# EAGLE design version 1.3 (EAGLE 8.1.0)

## Sheet 1 of 4
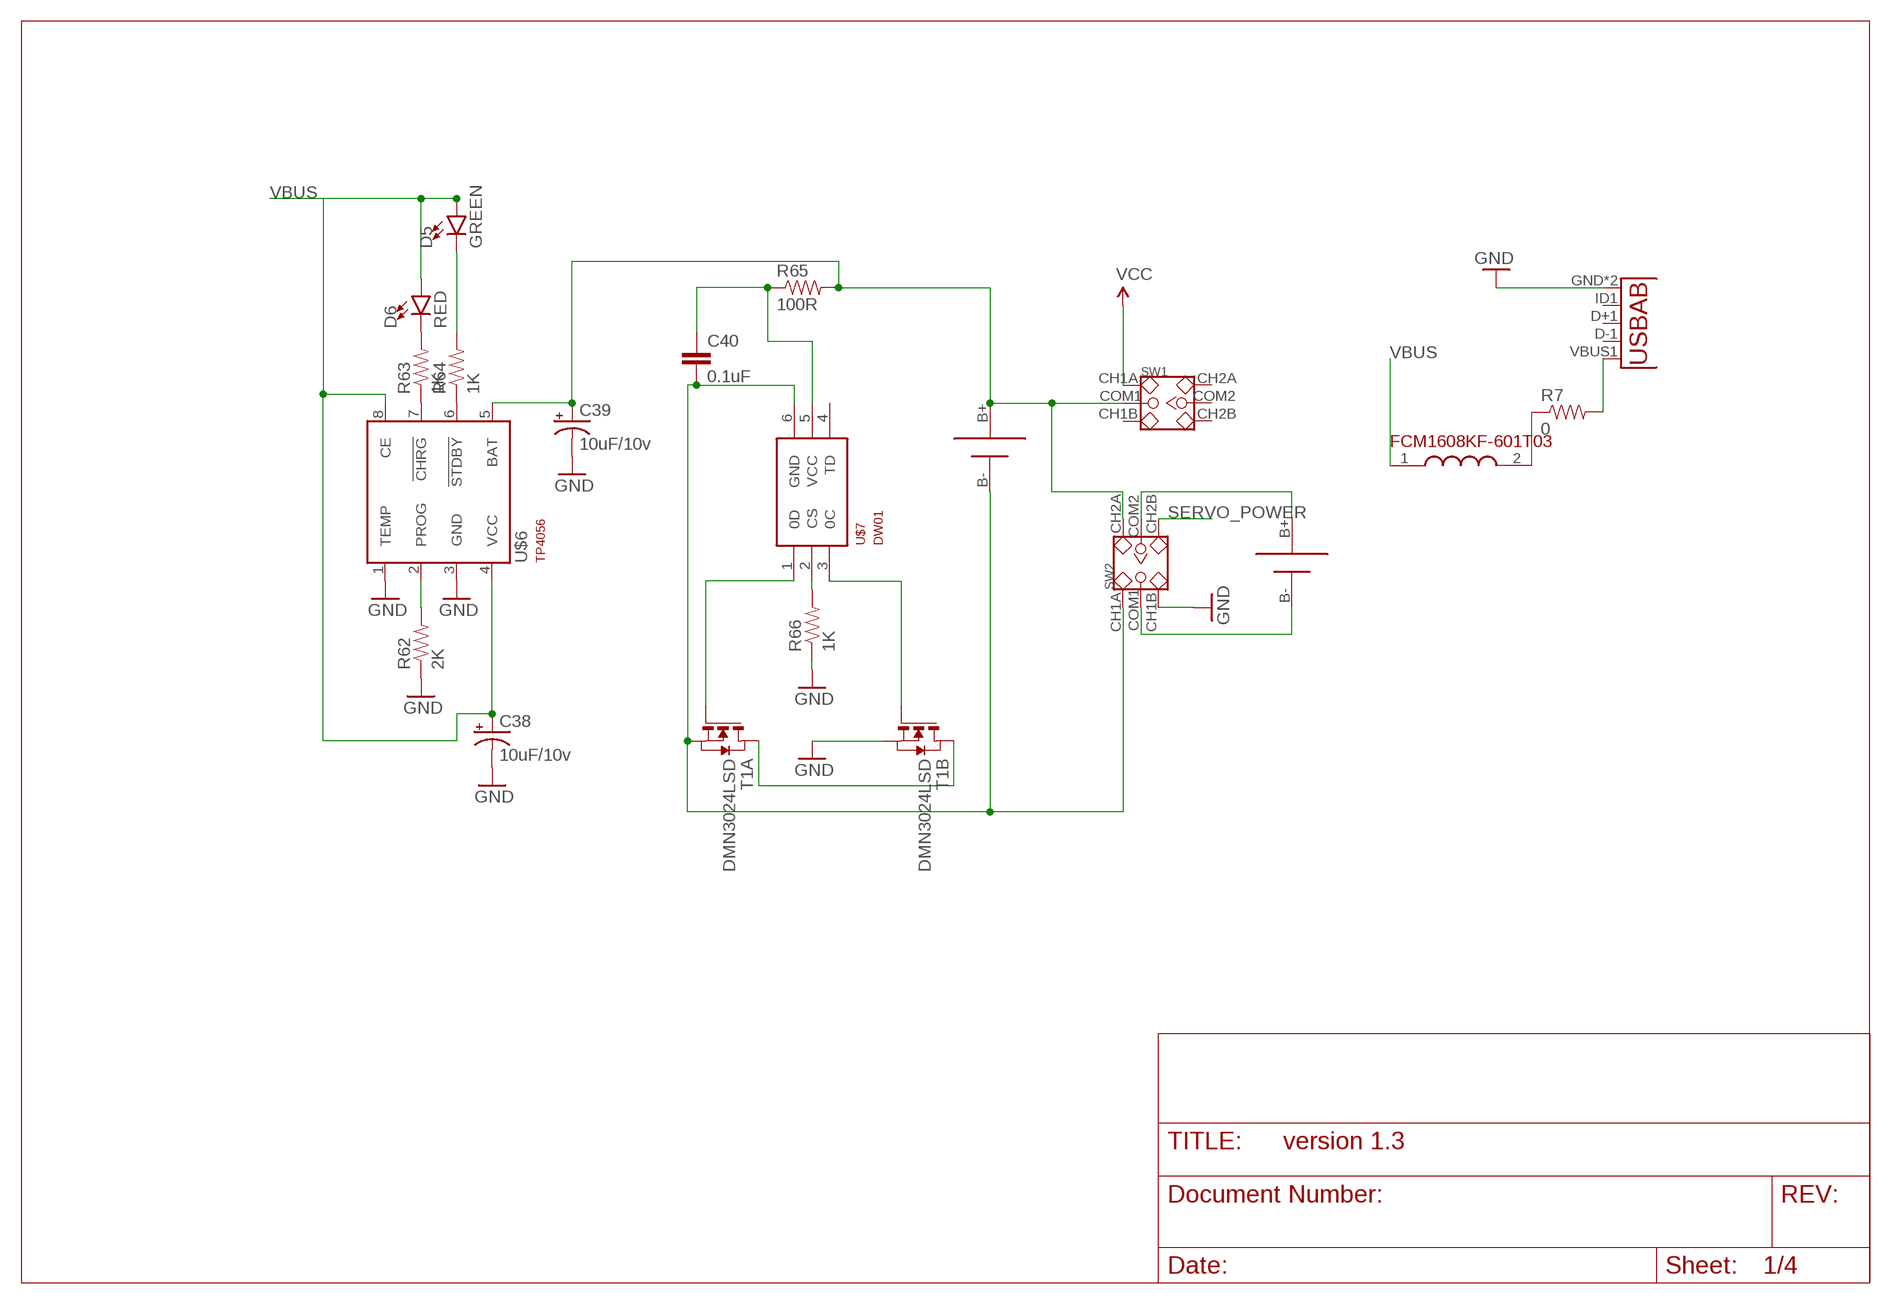
[diagram p0: schematic, sheet 1]

### Parts
C38  10uF/10v  CAP_POL1206-KIT  [EIA3216-KIT]
C39  10uF/10v  CAP_POL1206-KIT  [EIA3216-KIT]
C40  0.1uF  0.1UF-100V-10%(0603)  [0603-CAP]
D5  GREEN  LED-BLUE0603  [LED-0603]
D6  RED  LED-BLUE0603  [LED-0603]
R7  0  RESISTOR0805-RES  [0805]
R62  2K  1KOHM1/10W1%(0603)  [0603-RES]
R63  1K  1KOHM1/10W1%(0603)  [0603-RES]
R64  1K  1KOHM1/10W1%(0603)  [0603-RES]
R65  100R  1KOHM1/10W1%(0603)  [0603-RES]
R66  1K  1KOHM1/10W1%(0603)  [0603-RES]
SW1  SMD-TOGGLE-SWITCH-2CH(2X3P-7X3.5MM)  [SW6-2.54-SMD-7.0X3.5X1.5MM]
SW2  SMD-TOGGLE-SWITCH-2CH(2X3P-7X3.5MM)  [SW6-2.54-SMD-7.0X3.5X1.5MM]
T1  DMN3024LSD  [TSSOP-8]
U1  USB""  [USB-MICRO-SMD]
U$4  FCM1608KF-601T03  [FCM1608KF-601T03]
U$5  18650SMD  [18650SMD]
U$6  TP4056  [SOT23-8]
U$7  DW01  [SOT23-6]
U$8  18650SMD  [18650SMD]

### Nets
GND: C38.C(-) C39.C(-) R62.1 R66.1 SW2.CH1B T1.6(B:S) T1.7(B:S) U1.GND U1.GND1(GND) U$6.1(TEMP) U$6.3(GND) ; also sheet 2,3,4
N$3: R7.2 U1.VBUS1(VBUS)
N$4: C39.A(+) R65.2 SW1.COM1 SW2.CH2A U$5.B+ U$6.5(BAT)
N$9: SW2.COM2 U$8.B+
N$10: SW2.COM1 U$8.B-
N$11: R7.1 U$4.2(2.OUT)
N$58: R62.2 U$6.2(PROG)
N$59: R63.1 U$6.7(!CHRG)
N$60: R64.1 U$6.6(!STDBY)
N$61: D6.C R63.2
N$62: D5.C R64.2
N$65: C40.1 R65.1 U$7.5(VCC)
N$66: C40.2 SW2.CH1A T1.2(A:S) T1.3(A:S) U$5.B- U$7.6(GND)
N$67: T1.4(A:G) U$7.1(0D)
N$68: R66.2 U$7.2(CS)
N$69: T1.1(A:D) T1.8(B:D)
N$70: T1.5(B:G) U$7.3(0C)
SERVO_POWER: SW2.CH2B ; also sheet 4
VBUS: C38.A(+) D5.A D6.A U$4.1(1.IN) U$6.4(VCC) U$6.8(CE)
VCC: SW1.CH1A ; also sheet 2,3
Unconnected: SW1.CH1B SW1.CH2A SW1.CH2B SW1.COM2 U1.D+1(D+) U1.D-1(D-) U1.ID1(USBID) U$7.4(TD)

## Sheet 2 of 4
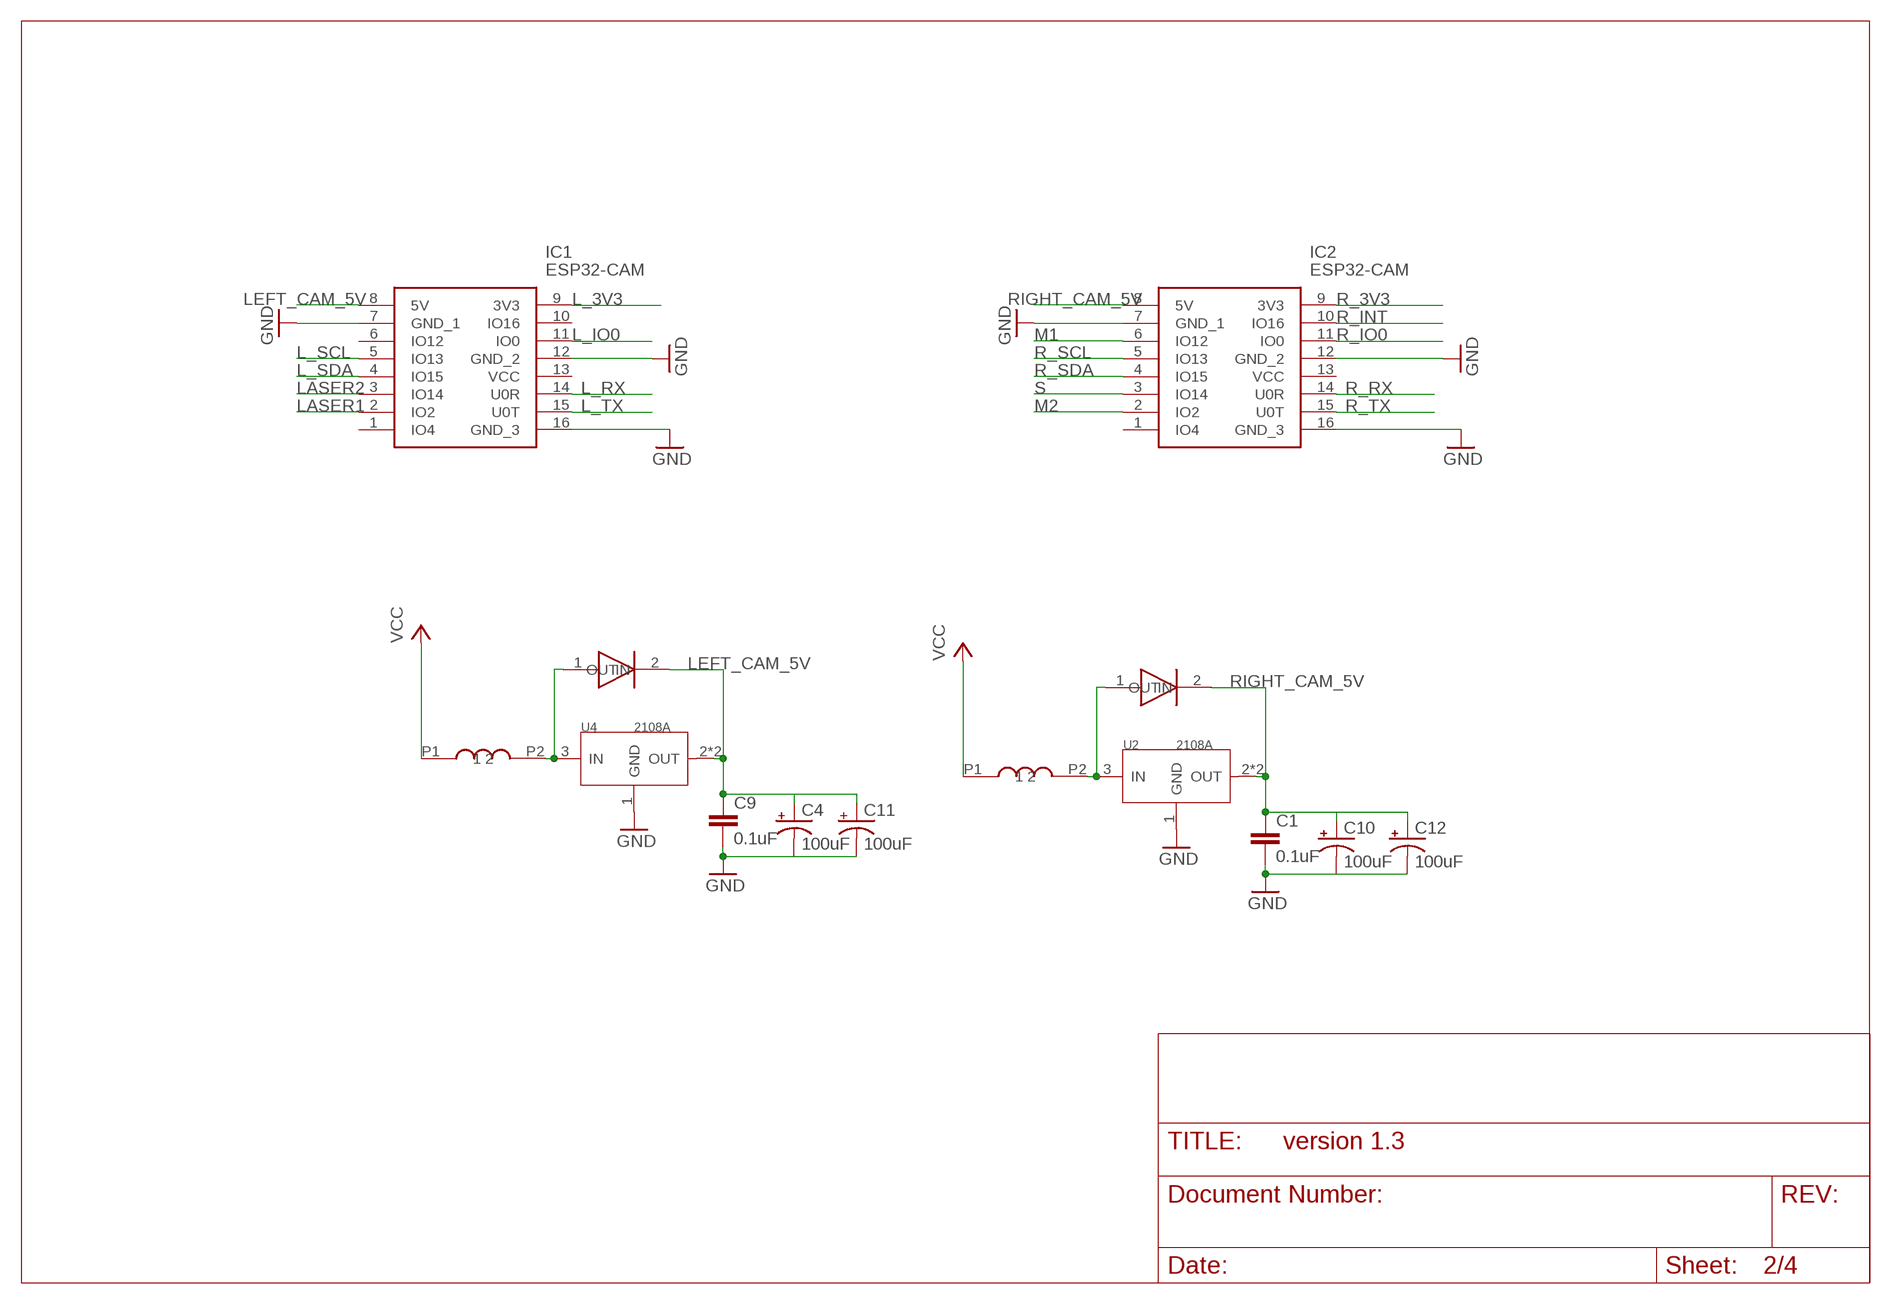
[diagram p1: schematic, sheet 2]

### Parts
C1  0.1uF  0.1UF-25V-5%(0603)  [0603-CAP]
C4  100uF  CPOL-USE/7260-38R  [E/7260-38R]
C9  0.1uF  0.1UF-25V-5%(0603)  [0603-CAP]
C10  100uF  CPOL-USE/7260-38R  [E/7260-38R]
C11  100uF  CPOL-USE/7260-38R  [E/7260-38R]
C12  100uF  CPOL-USE/7260-38R  [E/7260-38R]
IC1  ESP32-CAM  [ESP32CAM]
IC2  ESP32-CAM  [ESP32CAM]
U2  2108A  PMIC-CJA1117B-3.3(SOT-89)  [SOT-89]
U4  2108A  PMIC-CJA1117B-3.3(SOT-89)  [SOT-89]
U$13  CD54  [CD54]
U$14  SMA-SS34  [SMA-SS34]
U$15  SMA-SS34  [SMA-SS34]
U$16  CD54  [CD54]

### Nets
GND: C1.2 C4.- C9.2 C10.- C11.- C12.- IC1.7(GND_1) IC1.12(GND_2) IC1.16(GND_3) IC2.7(GND_1) IC2.12(GND_2) IC2.16(GND_3) U2.1(GND) U4.1(GND) ; also sheet 1,3,4
L_3V3: IC1.9(3V3) ; also sheet 4
L_IO0: IC1.11(IO0) ; also sheet 4
L_RX: IC1.14(U0R) ; also sheet 4
L_SCL: IC1.5(IO13) ; also sheet 4
L_SDA: IC1.4(IO15) ; also sheet 4
L_TX: IC1.15(U0T) ; also sheet 4
LASER1: IC1.2(IO2) ; also sheet 3
LASER2: IC1.3(IO14) ; also sheet 3
LEFT_CAM_5V: C4.+ C9.1 C11.+ IC1.8(5V) U4.2(OUT) U4.4(OUT) U$14.2(OUT) ; also sheet 4
M1: IC2.6(IO12) ; also sheet 4
M2: IC2.2(IO2) ; also sheet 4
N$17: U4.3(IN) U$13.P2 U$14.1(IN)
N$19: U2.3(IN) U$15.1(IN) U$16.P2
R_3V3: IC2.9(3V3) ; also sheet 4
R_INT: IC2.10(IO16) ; also sheet 4
R_IO0: IC2.11(IO0) ; also sheet 4
R_RX: IC2.14(U0R) ; also sheet 4
R_SCL: IC2.5(IO13) ; also sheet 4
R_SDA: IC2.4(IO15) ; also sheet 4
R_TX: IC2.15(U0T) ; also sheet 4
RIGHT_CAM_5V: C1.1 C10.+ C12.+ IC2.8(5V) U2.2(OUT) U2.4(OUT) U$15.2(OUT) ; also sheet 4
S: IC2.3(IO14) ; also sheet 4
VCC: U$13.P1 U$16.P1 ; also sheet 1,3
Unconnected: IC1.1(IO4) IC1.6(IO12) IC1.10(IO16) IC1.13(VCC) IC2.1(IO4) IC2.13(VCC)

## Sheet 3 of 4
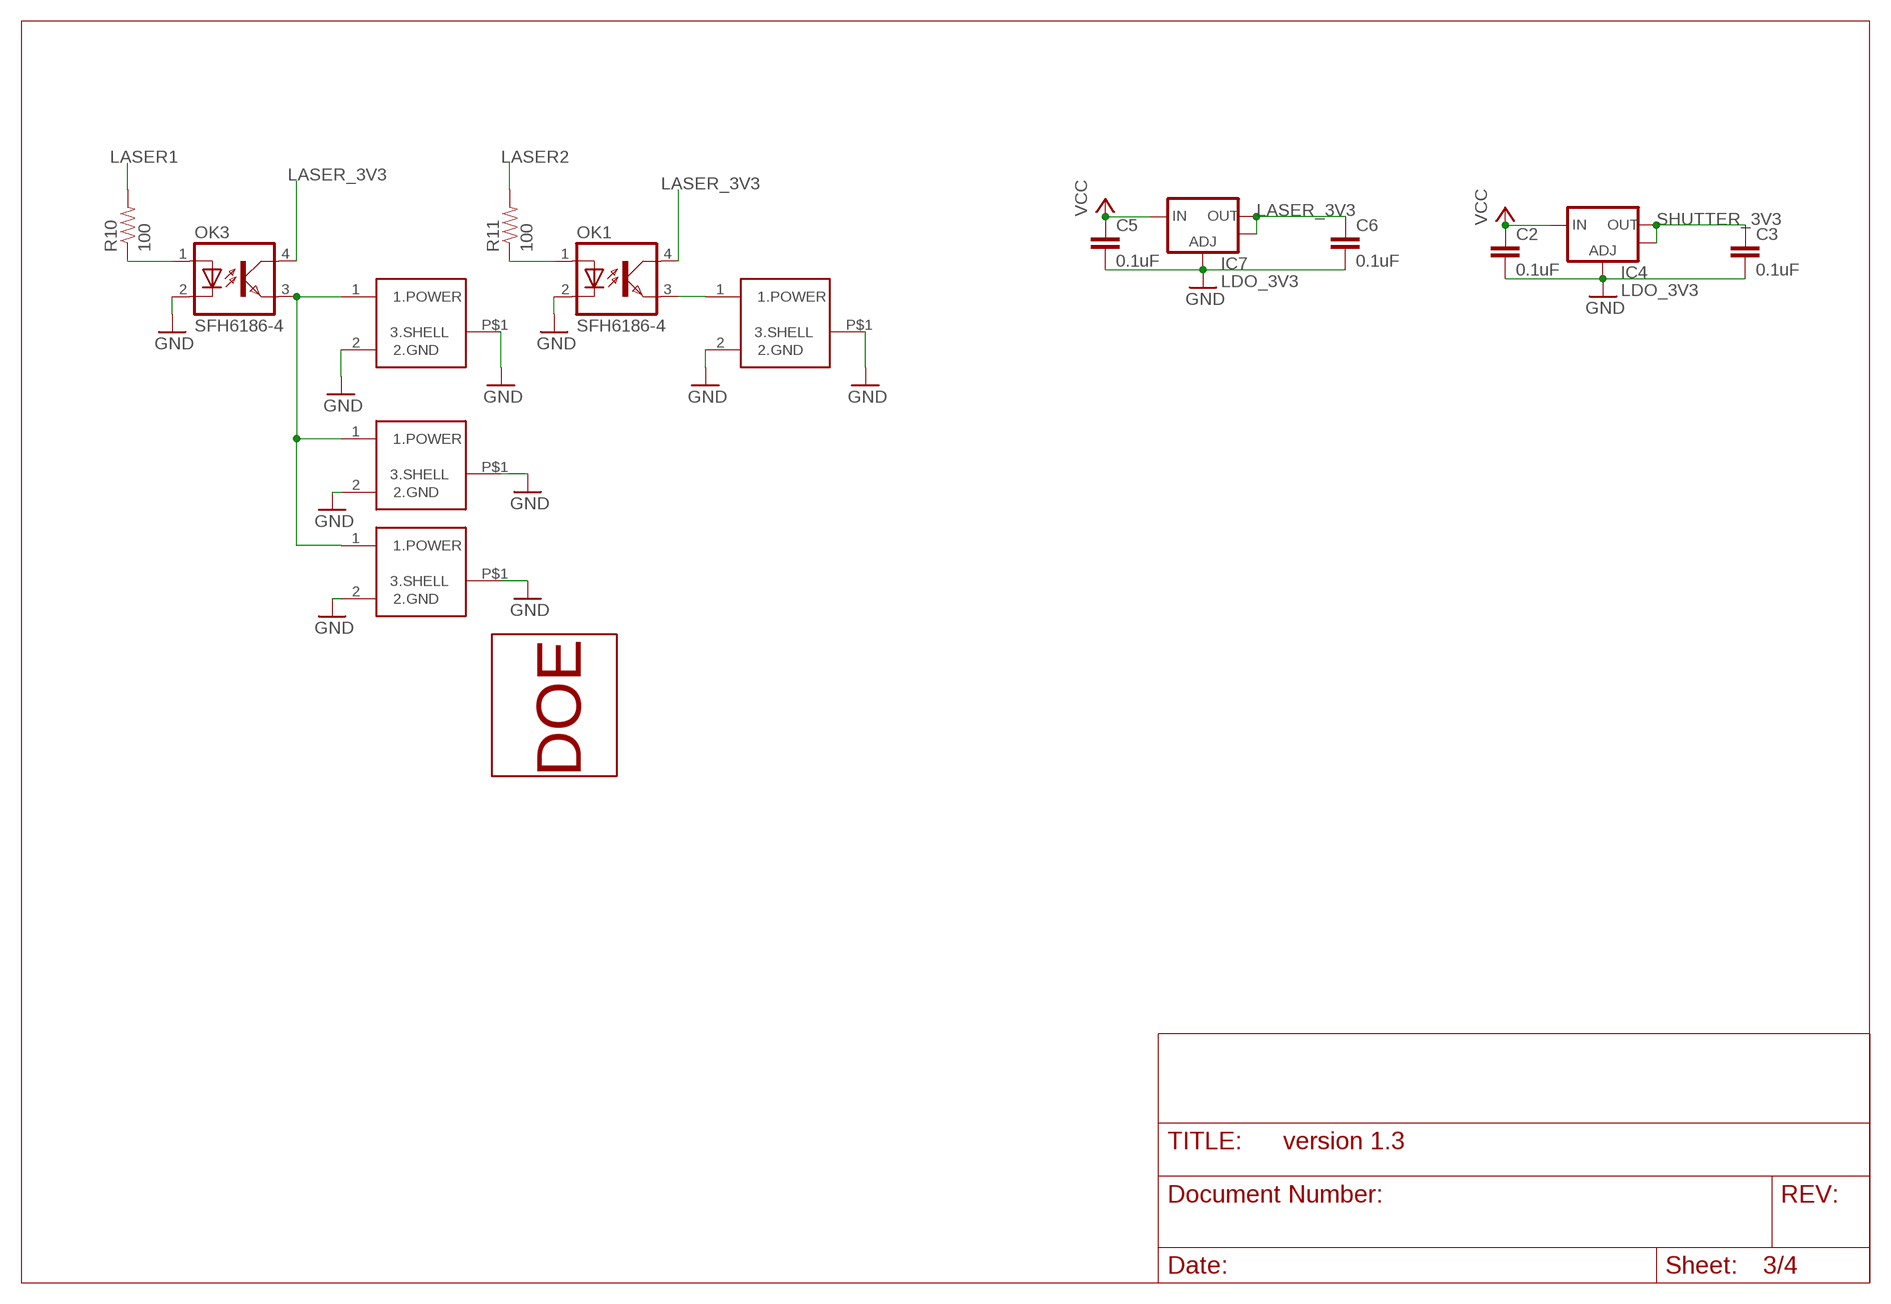
[diagram p2: schematic, sheet 3]

### Parts
C2  0.1uF  0.1UF-100V-10%(0603)  [0603-CAP]
C3  0.1uF  0.1UF-100V-10%(0603)  [0603-CAP]
C5  0.1uF  0.1UF-100V-10%(0603)  [0603-CAP]
C6  0.1uF  0.1UF-100V-10%(0603)  [0603-CAP]
IC4  LDO_3V3  V_REG_LM1117SOT223  [SOT223]
IC7  LDO_3V3  V_REG_LM1117SOT223  [SOT223]
OK1  SFH6186-4  [SMD4-7]
OK3  SFH6186-4  [SMD4-7]
R10  100  1KOHM1/10W1%(0603)  [0603-RES]
R11  100  1KOHM1/10W1%(0603)  [0603-RES]
U$1  OD-6.5MM-LASER  [OD-6.5MM-LASER]
U$2  OD-6.5MM-LASER  [OD-6.5MM-LASER]
U$3  DOE-MODULE  [DOE-MODULE]
U$9  OD-6.5MM-LASER  [OD-6.5MM-LASER]
U$20  OD-12MM-LASER  [OD-12MM-LASER]

### Nets
GND: C2.2 C3.2 C5.2 C6.2 IC4.1(ADJ) IC7.1(ADJ) OK1.2(C) OK3.2(C) U$1.2(2.GND) U$1.P$1(3.SHELL) U$2.2(2.GND) U$2.P$1(3.SHELL) U$9.2(2.GND) U$9.P$1(3.SHELL) U$20.2(2.GND) U$20.P$1(3.SHELL) ; also sheet 1,2,4
LASER1: R10.2 ; also sheet 2
LASER2: R11.2 ; also sheet 2
LASER_3V3: C6.1 IC7.2(OUT) IC7.4(OUT) OK1.4(COL) OK3.4(COL)
N$5: OK3.3(EMIT) U$1.1(1.POWER) U$2.1(1.POWER) U$9.1(1.POWER)
N$6: OK1.3(EMIT) U$20.1(1.POWER)
N$7: OK3.1(A) R10.1
N$8: OK1.1(A) R11.1
SHUTTER_3V3: C3.1 IC4.2(OUT) IC4.4(OUT) ; also sheet 4
VCC: C2.1 C5.1 IC4.3(IN) IC7.3(IN) ; also sheet 1,2

## Sheet 4 of 4
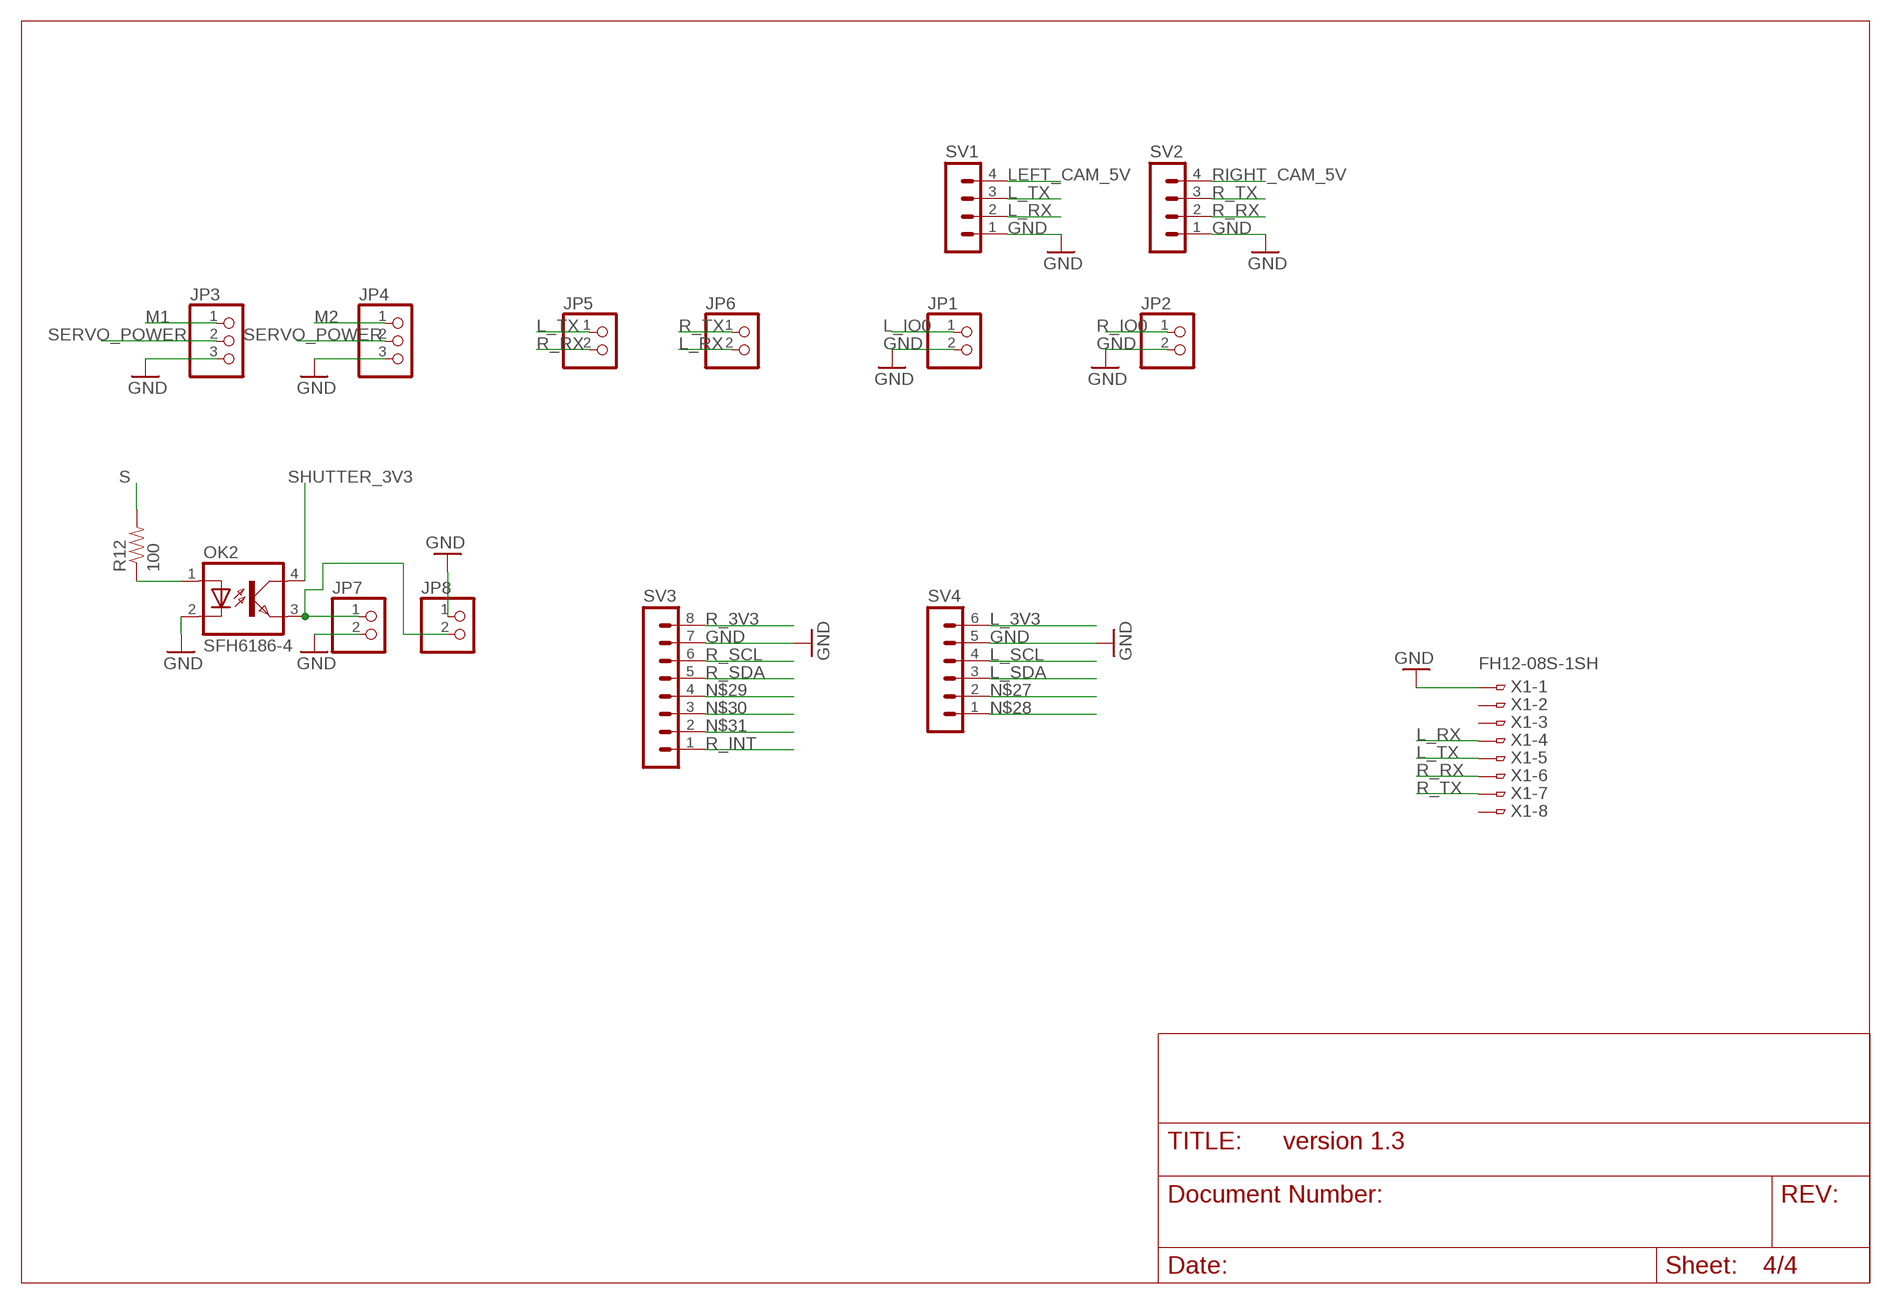
[diagram p3: schematic, sheet 4]

### Parts
JP1  PINHD-1X2  [1X02]
JP2  PINHD-1X2  [1X02]
JP3  PINHD-1X3  [1X03]
JP4  PINHD-1X3  [1X03]
JP5  PINHD-1X2  [1X02]
JP6  PINHD-1X2  [1X02]
JP7  PINHD-1X2  [1X02]
JP8  PINHD-1X2  [1X02]
OK2  SFH6186-4  [SMD4-7]
R12  100  1KOHM1/10W1%(0603)  [0603-RES]
SV1  MA04-1  [MA04-1]
SV2  MA04-1  [MA04-1]
SV3  MA08-1  [MA08-1]
SV4  MA06-1  [MA06-1]
X1  FH12-08S-1SH  [FH12-08S-1SH]

### Nets
GND: JP1.2 JP2.2 JP3.3 JP4.3 JP7.2 JP8.1 OK2.2(C) SV1.1 SV2.1 SV3.7 SV4.5 X1.1 ; also sheet 1,2,3
L_3V3: SV4.6 ; also sheet 2
L_IO0: JP1.1 ; also sheet 2
L_RX: JP6.2 SV1.2 X1.4 ; also sheet 2
L_SCL: SV4.4 ; also sheet 2
L_SDA: SV4.3 ; also sheet 2
L_TX: JP5.1 SV1.3 X1.5 ; also sheet 2
LEFT_CAM_5V: SV1.4 ; also sheet 2
M1: JP3.1 ; also sheet 2
M2: JP4.1 ; also sheet 2
N$20: OK2.1(A) R12.1
N$22: JP7.1 JP8.2 OK2.3(EMIT)
N$27: SV4.2
N$28: SV4.1
N$29: SV3.4
N$30: SV3.3
N$31: SV3.2
R_3V3: SV3.8 ; also sheet 2
R_INT: SV3.1 ; also sheet 2
R_IO0: JP2.1 ; also sheet 2
R_RX: JP5.2 SV2.2 X1.6 ; also sheet 2
R_SCL: SV3.6 ; also sheet 2
R_SDA: SV3.5 ; also sheet 2
R_TX: JP6.1 SV2.3 X1.7 ; also sheet 2
RIGHT_CAM_5V: SV2.4 ; also sheet 2
S: R12.2 ; also sheet 2
SERVO_POWER: JP3.2 JP4.2 ; also sheet 1
SHUTTER_3V3: OK2.4(COL) ; also sheet 3
Unconnected: X1.2 X1.3 X1.8

## Library data of the parts
C1 C9 = SparkFun-Capacitors:0.1UF-25V-5%(0603): CAP-08604; PROD_ID: CAP-08604
C2 C3 C5 C6 C40 = SparkFun-Capacitors:0.1UF-100V-10%(0603): CAP-08390; PROD_ID: CAP-08390
C4 C10-C12 = adafruit:CPOL-US: POLARIZED CAPACITOR, American symbol
C38 C39 = SparkFun-Capacitors:CAP_POL: Capacitor Polarized These are standard SMD and PTH capacitors. Normally 10uF, 47uF, and 100uF in electrolytic and tantalum varieties. Always verify the external diameter of the through hole cap, it varies with capacity, voltage, and manufacturer. The EIA devices should be standard.
D5 D6 = SparkFun-LED:LED-BLUE: Blue SMD LED Used in manufacturing of various products at SparkFun Packages: 0603 - SMD 0603 package [Product Link] <http://www.digikey.com/product-detail/en/SMLE12BC7TT86/511-1589-2-ND/1641808> 1206 - SMD1206 package [Product Link] <http://www.digikey.com/product-detail/en/lite-on-inc/LTST-C150TBKT/160-1643-1-ND/573584> SparkFun Products: ESP8266 Thing-Dev Board <https://www.sparkfun.com/products/13711> RedBoard <https://www.sparkfun.com/products/12757>; PROD_ID: DIO-08575; VALUE: BLUE
IC1 IC2 = ESP32-CAM:ESP32-CAM: Modules PCBA Module RoHS Source: Datasheet <https://datasheet.lcsc.com/szlcsc/Ai-Thinker-ESP32-CAM_C277946.pdf>; DESCRIPTION: Modules PCBA Module RoHS; HEIGHT: 5mm; MANUFACTURER_NAME: Ai-Thinker; MANUFACTURER_PART_NUMBER: ESP32-CAM
IC4 IC7 = SparkFun-PowerIC:V_REG_LM1117: Voltage Regulator LM1117 Standard adjustable voltage regulator but in SMD form. Spark Fun Electronics SKU : COM-00595
JP1 JP2 JP5-JP8 = pinhead:PINHD-1X2: PIN HEADER
JP3 JP4 = adafruit:PINHD-1X3: PIN HEADER
OK1-OK3 = optocoupler:SFH618?*: Optocoupler, Phototransistor Output, Low Input Current Source: Data sheet <http://www.vishay.com/docs/83673/sfh618.pdf>; MF: VISHAY/TELEFUNKEN; MPN: SFH6186-4; OC_FARNELL: 1469530; OC_NEWARK: 21H7753
R7 = SparkFun-Resistors:RESISTOR: Resistor Basic schematic elements and footprints for 0603, 1206, and PTH resistors.
R10-R12 R62 R65 = SparkFun-Resistors:1KOHM1/10W1%(0603): RES-07856; PROD_ID: RES-07856; VALUE: 1K
R63 R64 R66 = SparkFun-Resistors:1KOHM1/10W1%(0603): RES-07856; PROD_ID: RES-07856
SV1 SV2 = con-lstb:MA04-1: PIN HEADER; OC_FARNELL: unknown; OC_NEWARK: unknown
SV3 = con-lstb:MA08-1: PIN HEADER; OC_FARNELL: unknown; OC_NEWARK: unknown
SV4 = con-lstb:MA06-1: PIN HEADER; OC_FARNELL: unknown; OC_NEWARK: unknown
SW1 SW2 = Seeed-OPL-Switch:SMD-TOGGLE-SWITCH-2CH(2X3P-7X3.5MM): 311030005
T1 = FS8205A:DMN3024LSD: DUAL N-CHANNEL ENHANCEMENT MODE MOSFET data sheet <http://goo.gl/dRgboR> Dave.Calaway Eagle Library <https://goo.gl/Muy1Tr>
U1 = MicroUSB Long GND:USB: This is a USB AB connector that is compatible with USB OTG. i.e. this connector can serve as a host or device
U2 U4 = Seeed-OPL-ic:PMIC-CJA1117B-3.3(SOT-89): 310030095; MPN: CJA1117B-3.3; VALUE: CJA1117B-3.3-SOT89
U$1 U$2 U$9 = OD-6.5MM-LASER:OD-6.5MM-LASER
U$3 = DOE-MODULE:DOE-MODULE
U$4 = FCM1608KF-601T03:FCM1608KF-601T03
U$5 U$8 = 18650SMD:18650SMD
U$6 = TP4056:TP4056: TP4056 Data sheet <http://goo.gl/J7k8TF> Dave.Calaway Eagle Library <https://goo.gl/Muy1Tr>
U$7 = DW01:DW01: The DW01-P battery protection IC is designed to protect lithium-ion/polymer battery from damage or degrading the lifetime due to overcharge, overdischarge, and/or overcurrent for one-cell lithium-ion/polymer battery powered systems, such as cellular phones. Data sheet <http://goo.gl/4y108d> Dave.Calaway Eagle Library <https://goo.gl/Muy1Tr>
U$13 U$16 = CD54:CD54
U$14 U$15 = SMA-SS34:SMA-SS34
U$20 = OD-12MM-LASER:OD-12MM-LASER
X1 = con-hirose:FH12-08S-1S: 1mm Pitch Connectors For FPC/FFC Source: Data sheet <http://www.hirose.co.jp/cataloge_hp/e58605370.pdf>; OC_FARNELL: unknown; OC_NEWARK: unknown

## Board
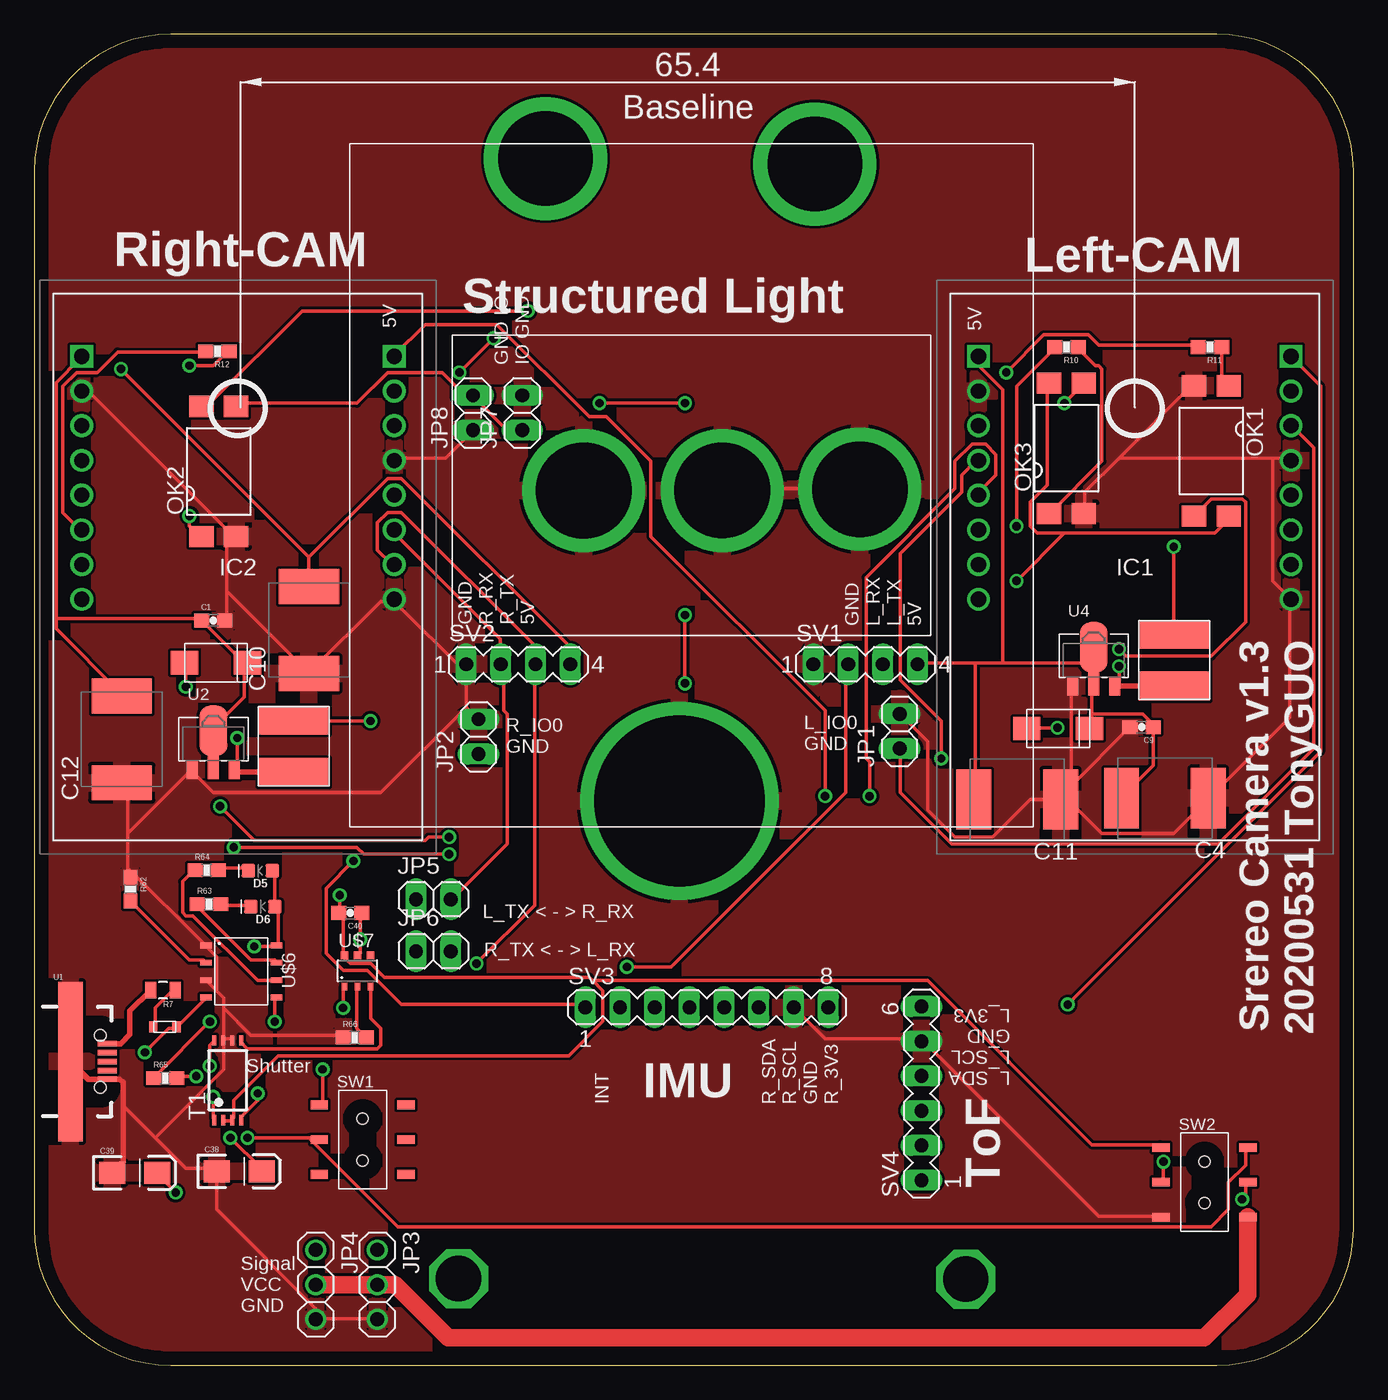
[diagram p4: board, top side]
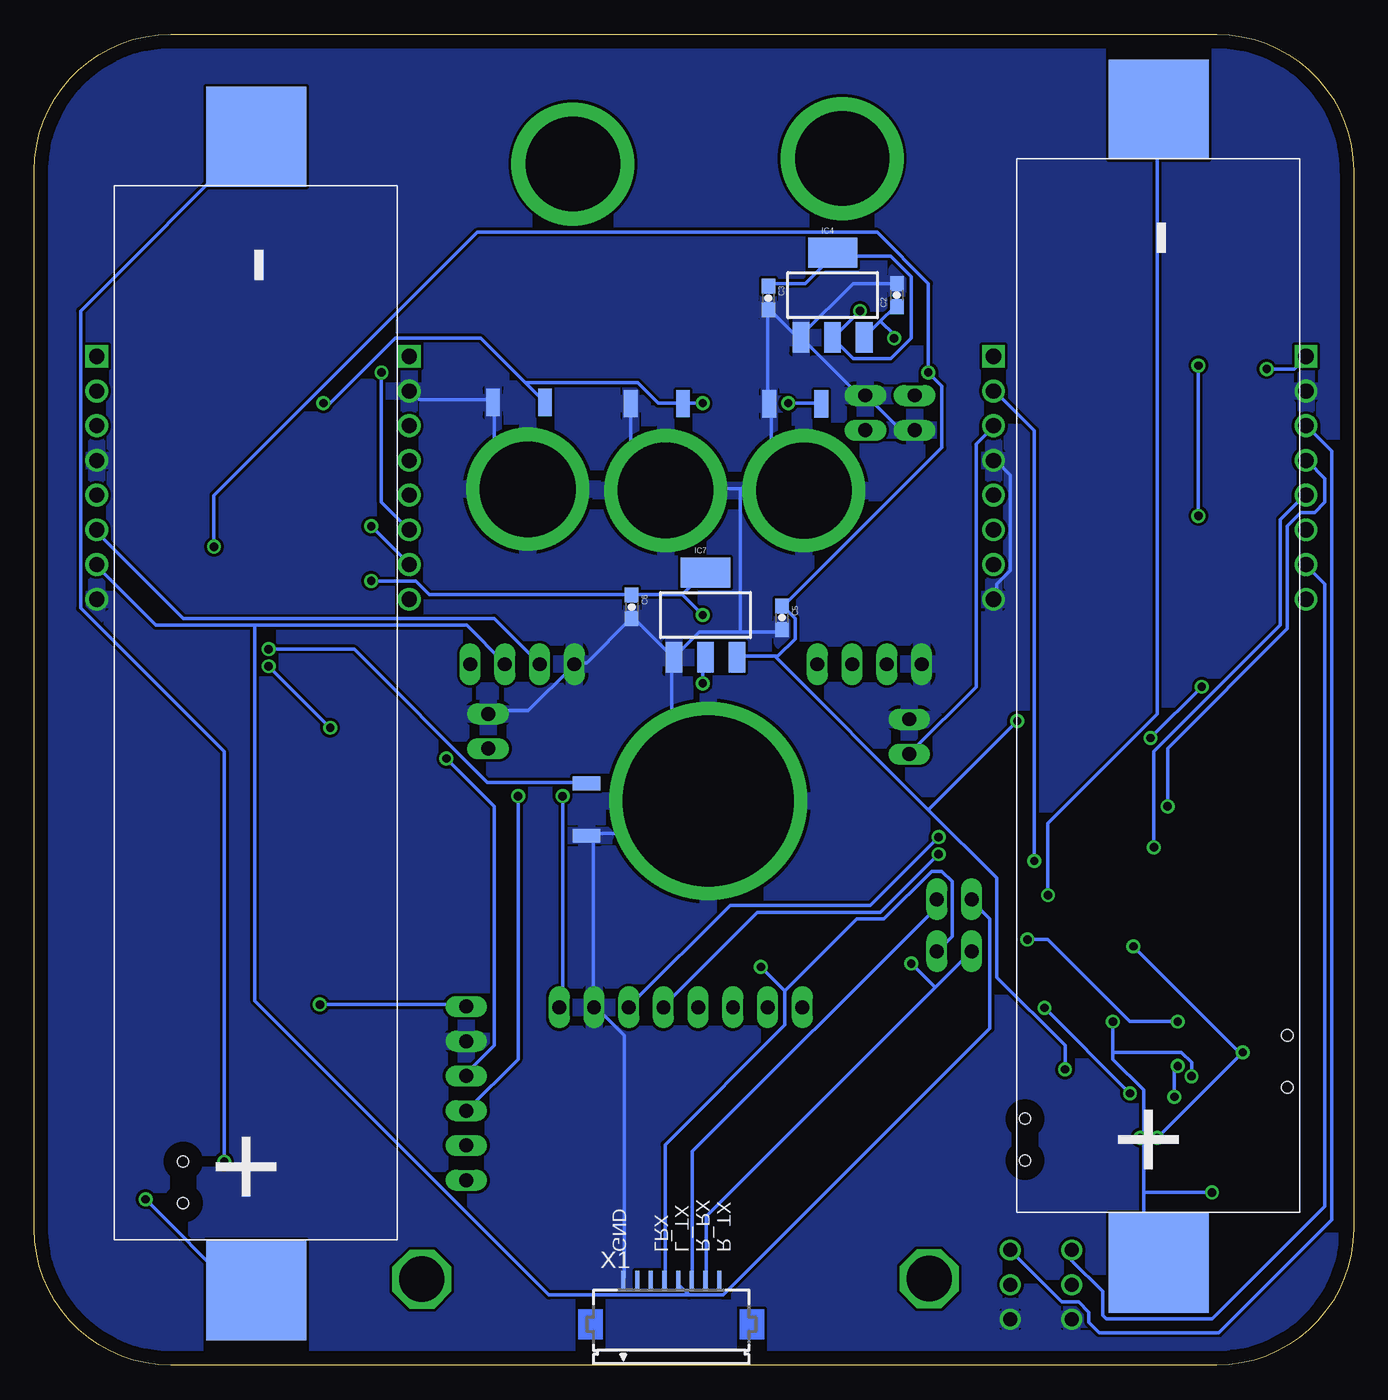
[diagram p5: board, bottom side, seen from below]

Size 96.5 x 97.4 mm. Coordinates in mm from the lower left corner, seen from the top.
Outline: 96.5,10 96.5,87.4 arc90 86.5,97.4 10,97.4 arc90 0,87.4 0,10 arc90 10,0 86.5,0 arc90 96.5,10
Copper layers (1*16): Top 0.035mm / dielectric 1.5mm / Bottom 0.035mm
Design rules "default": minimum track width 10mil, minimum drill 24mil, track to track 8mil, track to pad 8mil, pad to pad 8mil, via to via 8mil, smd to smd 8mil, copper to edge 40mil, drill to drill 8mil, minimum pad ring 10mil, minimum via ring 8mil, stop-mask expansion 4mil, vias tented up to drill 0mil, thermal gap 10mil

### Footprints (pad centres in the part's own frame; a part is rotated, then mirrored left to right if it is on the bottom)
0603-CAP = smd 1.1 x 1: 1 -0.85,0; 2 0.85,0
E/7260-38R = smd 2.55 x 4.4: + 3.175,0; - -3.175,0
EIA3216-KIT = smd 1.9 x 1.6: A 1.65,0; C -1.65,0
LED-0603 = smd 1 x 1: A -0.877,0; C 0.877,0
ESP32CAM = drill 1.11 pad 1.665: 1 0,0; 2 0,2.54; 3 0,5.08; 4 0,7.62; 5 0,10.16; 6 0,12.7; 7 0,15.24; 10 22.86,15.24; 11 22.86,12.7; 12 22.86,10.16; 13 22.86,7.62; 14 22.86,5.08; 15 22.86,2.54; 16 22.86,0 | drill 1.11 pad 1.665 square: 8 0,17.78; 9 22.86,17.78
SOT223 = smd 1.219 x 2.235: 1 -2.311,-3.099; 2 0,-3.099; 3 2.311,-3.099 | smd 3.6 x 2.2: 4 0,3.099
1X02 = drill 1.016 long: 1 -1.27,0; 2 1.27,0
1X03 = drill 1.016: 1 -2.54,0; 2 0,0; 3 2.54,0
SMD4-7 = smd 1.78 x 1.55: 1 -1.27,-4.77; 2 1.27,-4.77; 3 1.27,4.77; 4 -1.27,4.77
0805 = smd 0.8 x 1.2: 1 -0.9,0; 2 0.9,0
0603-RES = smd 1.1 x 1: 1 -0.85,0; 2 0.85,0
MA04-1 = drill 1.016 long: 1 -3.81,0; 2 -1.27,0; 3 1.27,0; 4 3.81,0
MA08-1 = drill 1.016 long: 1 -8.89,0; 2 -6.35,0; 3 -3.81,0; 4 -1.27,0; 5 1.27,0; 6 3.81,0; 7 6.35,0; 8 8.89,0
MA06-1 = drill 1.016 long: 1 -6.35,0; 2 -3.81,0; 3 -1.27,0; 4 1.27,0; 5 3.81,0; 6 6.35,0
SW6-2.54-SMD-7.0X3.5X1.5MM = smd 1.27 x 0.635: CH1A -3.175,2.54; CH1B -3.175,-2.54; CH2A 3.175,2.54; CH2B 3.175,-2.54; COM1 -3.175,0; COM2 3.175,0 | hole 0.813: 0,1.524; 0,-1.524
TSSOP-8 = smd 0.3 x 0.75: 1 -0.975,-2.925; 2 -0.325,-2.925; 3 0.325,-2.925; 4 0.975,-2.925; 5 0.975,2.925; 6 0.325,2.925; 7 -0.325,2.925; 8 -0.975,2.925
USB-MICRO-SMD = smd 1.4 x 0.4: D+1 2.7,0; D-1 2.7,0.65; GND1 2.7,-1.3; ID1 2.7,-0.65; VBUS1 2.7,1.3 | smd 1.778 x 11.684: GND 0,0 | hole 0.85: 2.2,1.9; 2.2,-1.9
SOT-89 = smd 0.8 x 1.4: 1 -1.524,-1.905; 3 1.524,-1.905 | smd 0.8 x 1.9: 2 0,-1.651 | smd 2.032 x 3.65: 4 0,0.94
OD-6.5MM-LASER = smd 2 x 1: 1 -6.35,1.27; 2 -6.35,-2.54 | drill 7 pad 9: P$1 0,0
FCM1608KF-601T03 = smd 0.6 x 0.8: 1 -0.05,0.4; 2 1.65,0.4
18650SMD = smd 7.3 x 7.3: B+ -3.7,10.3; B- 80.7,10.3
SOT23-8 = smd 0.42 x 0.835: 1 -1.905,-2.58; 2 -0.635,-2.58; 3 0.635,-2.58; 4 1.905,-2.58; 5 1.905,2.58; 6 0.635,2.58; 7 -0.635,2.58; 8 -1.905,2.58
SOT23-6 = smd 0.4 x 0.55: 1 -0.95,-1.15; 2 0,-1.15; 3 0.95,-1.15 | smd 0.55 x 0.55: 4 0.95,1.15; 5 0,1.15; 6 -0.95,1.15
CD54 = smd 5.2 x 2.1: P1 2.6,-1; P2 2.6,-4.8
SMA-SS34 = smd 2 x 1.7: 1 0,-1.4; 2 4.6,-1.4
OD-12MM-LASER = smd 2 x 1: 1 -8.89,1.27; 2 -8.89,-2.54 | drill 12.5 pad 14.5: P$1 0,0
FH12-08S-1SH = smd 0.3 x 1.3: 1 -3.5,3.25; 2 -2.5,3.25; 3 -1.5,3.25; 4 -0.5,3.25; 5 0.5,3.25; 6 1.5,3.25; 7 2.5,3.25; 8 3.5,3.25

### Placement (x,y rotation side)
C1  13.1,54.5 0 top
C2  33.4,78.3 90 bottom
C3  42.8,78.1 270 bottom
C4  82.7,41.5 180 top
C5  41.8,54.7 270 bottom
C6  52.8,55.5 270 bottom
C9  81,46.7 180 top
C10  20.1,53.8 90 top
C11  71.9,41.4 180 top
C12  6.4,45.8 90 top
C38  15,14.2 0 top
C39  7.35,14.09 0 top
C40  23.12,33.1 180 top
D5  16.54,36.19 180 top
D6  16.73,33.56 180 top
IC1  69.07,56.05 0 top
IC2  3.47,56.05 0 top
IC4  38.1,78.3 0 bottom
IC7  47.4,54.9 0 bottom
JP1  63.3,46.4 90 top
JP2  32.5,46 90 top
JP3  25.1,5.9 270 top
JP4  20.6,5.9 270 top
JP5  29.2,34.1 0 top
JP6  29.2,30.3 0 top
JP7  35.7,69.7 90 top
JP8  32.1,69.7 90 top
OK1  86.1,66.9 180 top
OK2  13.5,65.4 0 top
OK3  75.5,67.1 0 top
R7  9.42,27.44 180 top
R10  75.5,74.5 180 top
R11  86,74.5 180 top
R12  13.4,74.2 180 top
R62  7.04,34.84 270 top
R63  12.79,33.74 0 top
R64  12.62,36.23 0 top
R65  9.59,21.02 0 top
R66  23.44,23.99 0 top
SV1  60.8,51.3 0 top
SV2  35.4,51.3 0 top
SV3  49.2,26.2 0 top
SV4  64.9,19.9 90 top
SW1  24.03,16.52 0 top
SW2  85.6,13.4 0 top
T1  14.16,20.86 0 top
U1  2.65,22.23 0 top
U2  13.1,45.5 0 top
U4  77.5,51.6 0 top
U$1  50.32,64.02 270 bottom
U$2  60.4,64.1 270 bottom
U$3  23.08,39.39 0 top
U$4  10.36,25.18 180 top
U$5  3.95,11.19 90 bottom
U$6  15.14,28.82 270 top
U$7  23.64,28.86 0 top
U$8  69.95,9.2 90 bottom
U$9  40.2,64 270 bottom
U$13  80.8,54.5 0 top
U$14  72.6,48 0 top
U$15  11,52.8 0 top
U$16  16.4,48.2 0 top
U$20  47.2,41.3 0 bottom
X1  49.9,3 0 bottom

### Tracks (layer width: path | path; a pad name or v marks a point on that pad's centre or on a via)
GND
  Top 0.254: 79.35,66.4 84.6,71.65 OK1.2 | 79.35,66.4 76.85,63.9 76.85,62.4 OK3.2 | 79.35,66.4 90.6,66.4 | 90.6,66.4 91.85,66.4 IC1.12 | 74.85,41.4 75.85,42.4 | 75.85,42.4 C9.2 | 75.85,42.4 75.85,49.65 U4.1 | 75.85,42.4 C11.- | C11.- 75.35,41.65 78.1,38.9 83.35,38.9 85.85,41.4 C4.- 86.1,41.65 91.85,47.4 91.85,55.9 IC1.16 91.85,56.15 90.6,57.4 90.6,66.4 | SW2.CH1B 82.35,10.9 77.85,10.9 65.1,23.65 SV4.5 64.85,23.9 57.85,23.9 SV3.7 | 74.85,41.4 72.85,41.4 70.1,38.65 67.35,38.65 65.35,40.65 65.35,45.65 63.35,47.65 JP1.2 | 74.85,41.4 C11.- | 20.6,3.4 25.1,3.4 JP3.3 | 8.85,16.65 6.6,18.9 6.5,18.9 | 8.85,16.65 11.1,14.4 13.35,14.4 C38.C 13.35,11.4 20.6,4.15 20.6,3.4 | 20.6,3.4 JP4.3 | 13.85,23.9 14.35,23.9 T1.6 | 13.35,27.4 13.85,26.9 13.85,26.15 | 13.35,27.4 12.6,28.15 U$6.3 | 13.85,23.9 13.85,26.15 | 13.85,23.9 T1.7 13.85,23.65 13.85,21.65 8.85,16.65 | 13.35,27.4 13.35,29.9 12.6,30.65 U$6.1 12.35,30.9 6.85,36.4 | 13.85,26.15 15.85,24.15 22.35,24.15 R66.1 | 6.85,38.9 6.85,42.15 6.6,42.4 C12.- | 6.85,38.9 6.85,36.4 | 6.85,36.4 6.85,35.9 R62.1 | 6.85,38.9 11.35,43.4 U2.1 11.6,43.4 13.1,41.9 25.35,41.9 31.6,48.15 | 31.6,48.15 31.6,50.65 | 31.6,50.65 31.6,51.15 SV2.1 31.6,50.65 | 31.6,48.15 32.35,47.4 JP2.2 | 31.6,50.65 26.35,55.9 IC2.16 26.1,55.9 25.35,55.9 20.1,50.65 | 14.1,56.65 14.1,59.9 14.6,60.4 OK2.2 14.6,60.65 4.1,71.15 3.6,71.15 IC2.7 | 14.1,56.65 14.1,54.65 C1.2 | 14.1,56.65 20.1,50.65 | 20.1,50.65 C10.- | IC2.12 26.35,66.4 30.1,66.4 32.1,68.4 JP8.1 | U$2.P$1 60.35,64.15 50.35,64.15 U$1.P$1
  Top 0.406: U1.GND 3.95,20.93 U1.GND1 6.27,20.93 6.5,20.7 6.5,18.9 6.5,14.89 C39.C
  Bottom 0.254: 44.85,53.65 47.85,53.65 49.6,51.9 IC7.1 | 44.85,53.65 41.85,53.65 C5.2 | IC7.1 49.85,51.9 52.6,54.65 C6.2 52.85,54.65 56.1,51.4 56.85,51.4 SV1.1 57.1,51.15 60.35,47.9 63.1,47.9 JP1.2 | X1.1 53.35,6.4 53.35,24.15 55.35,26.15 SV3.7 55.6,26.4 55.6,38.9 | 49.85,38.9 49.6,38.9 U$20.P$1 49.85,38.9 | 49.85,38.9 55.6,38.9 | 55.6,38.9 55.85,38.9 U$20.2 55.6,38.9 | 49.85,38.9 49.85,51.65 IC7.1 | IC1.7 68.85,71.15 68.35,70.65 63.1,70.65 U$2.2 62.85,70.4 62.85,66.4 60.6,64.15 U$2.P$1 | U$1.2 52.85,70.15 52.85,66.65 50.35,64.15 U$1.P$1 50.1,64.15 44.85,64.15 | C2.2 36.6,79.15 40.35,75.4 IC4.1 | IC4.1 40.6,75.15 42.6,77.15 C3.2 42.85,77.15 42.85,70.4 U$9.2 42.6,70.15 42.6,66.4 40.35,64.15 | JP8.1 32.1,68.65 33.35,68.65 35.6,70.9 JP7.2 35.85,71.15 36.35,71.15 40.35,75.15 IC4.1 | 40.35,64.15 44.85,64.15 | 40.35,64.15 U$9.P$1 | IC2.16 26.1,56.15 26.1,57.15 25.1,58.15 25.1,65.15 26.1,66.15 IC2.12 | 44.85,64.15 44.85,53.65
  pour Bottom: -4.1,105.1 108.2,105.1 108.2,-7.6 -4.1,-7.6
  pour Top: -2.2,101.1 103.4,101.1 103.4,-6.4 -2.2,-6.4
L_3V3  (via drill 0.61)
  Top 0.254: v75.6,26.4 94.1,44.9 94.1,71.65 92.1,73.65 IC1.9
  Bottom 0.254: v75.6,26.4 65.1,26.4 SV4.6
L_IO0
  Top 0.254: JP1.1 63.35,44.9 63.35,41.9 67.1,38.15 86.6,38.15 93.6,45.15 93.6,67.15 92.1,68.65 IC1.11
L_RX  (via drill 0.61)
  Top 0.254: v43.35,29.15 46.6,29.15 59.35,41.9 59.35,51.15 SV1.2
  Bottom 0.254: SV1.2 59.6,51.4 62.85,54.65 85.6,54.65 91.85,60.9 IC1.14 | 41.6,27.4 41.6,24.9 50.35,16.15 50.35,6.4 X1.4 | 41.6,27.4 36.35,32.65 34.35,32.65 30.85,36.15 30.1,36.15 29.35,35.4 29.35,31.4 30.35,30.4 JP6.2 | 41.6,27.4 v43.35,29.15
L_SCL  (via drill 0.61)
  Top 0.254: v66.35,44.4 66.35,47.15 63.35,50.15 63.35,59.4 67.85,63.9 67.85,65.15 68.85,66.15 IC1.5
  Bottom 0.254: v66.35,44.4 62.85,40.9 62.85,23.4 64.85,21.4 SV4.4
L_SDA  (via drill 0.61)
  Top 0.254: v61.1,41.65 61.1,44.15 60.85,44.4 60.85,57.65 67.35,64.15 67.35,66.15 68.6,67.4 69.6,67.4 70.35,66.65 70.35,65.15 69.1,63.9 IC1.4
  Bottom 0.254: v61.1,41.65 61.1,22.4 64.85,18.65 SV4.3
L_TX
  Bottom 0.254: 80.35,54.15 87.6,54.15 91.85,58.4 IC1.15 | 80.35,54.15 64.85,54.15 62.1,51.4 SV1.3 | 48.6,5.15 49.35,5.9 49.35,6.15 X1.5 | 48.6,5.15 46.1,5.15 26.6,24.65 26.6,32.65 27.85,33.9 JP5.1 | 80.35,54.15 80.35,26.65 58.85,5.15 48.6,5.15
LASER1  (via drill 0.61)
  Top 0.254: v71.85,61.4 71.85,71.65 74.6,74.4 R10.2
  Bottom 0.254: v71.85,61.4 69.1,58.65 IC1.2
LASER2  (via drill 0.61)
  Top 0.254: v71.1,72.65 73.85,75.4 77.1,75.4 77.85,74.65 85.1,74.65 R11.2
  Bottom 0.254: v71.1,72.65 71.1,63.15 69.1,61.15 IC1.3
LASER_3V3  (via drill 0.61)
  Top 0.254: v47.6,54.9 v47.6,49.9 | 75.35,60.9 86.35,60.9 87.35,61.9 OK1.4 | 75.35,60.9 73.35,60.9 72.85,61.4 72.85,63.15 74.1,64.4 74.1,71.65 OK3.4 | 75.35,60.9 v71.85,57.4
  Bottom 0.254: 49.1,56.4 52.6,56.4 C6.1 52.85,56.4 67.6,56.4 68.6,57.4 v71.85,57.4 | 49.1,56.4 47.6,57.9 IC7.4 | v47.6,49.9 47.6,51.65 IC7.2 | 49.1,56.4 v47.6,54.9
LEFT_CAM_5V
  Top 0.254: C4.+ 79.6,41.65 81.85,43.9 C9.1 81.85,46.9 81.1,47.65 77.35,47.65 | 77.6,51.4 77.6,52.4 U4.4 77.6,51.4 | 77.6,51.4 77.6,50.15 U4.2 77.35,49.9 77.35,47.65 | 77.35,47.65 77.35,46.65 U$14.2 | 77.6,51.4 70.85,51.4 | 70.85,51.4 68.85,51.4 | 68.85,51.4 64.85,51.4 SV1.4 | 70.85,51.4 70.85,71.4 69.1,73.15 69.1,73.65 IC1.8 | 68.85,51.4 68.85,41.4 C11.+
M1
  Bottom 0.254: JP3.1 25.1,8.4 21.35,4.65 20.1,4.65 19.35,3.9 19.35,3.15 18.6,2.4 9.85,2.4 1.6,10.65 1.6,66.9 3.35,68.65 IC2.6
M2
  Bottom 0.254: JP4.1 20.6,7.65 18.35,5.4 18.35,3.65 18.1,3.4 10.35,3.4 2.1,11.65 2.1,57.15 3.35,58.4 IC2.2
N$1  (via drill 3.3)
  other vias: 31.04,6.35
N$2  (via drill 3.3)
  other vias: 68.14,6.31
N$3
  Top 0.406: U1.VBUS1 6.33,23.53 7,24.2 7,25.92 R7.2
N$4  (via drill 0.61)
  Top 0.254: v17.6,25.15 17.6,26.9 U$6.5 | v11.85,21.15 10.6,21.15 R65.2 | v15.6,16.65 20.1,16.65 | 20.1,16.65 20.85,16.65 SW1.COM1 | 20.1,16.65 26.6,10.15 86.1,10.15 87.35,11.4 87.35,13.4 88.6,14.65 88.6,15.9 SW2.CH2A | v10.35,12.65 9.1,13.9 C39.A
  Bottom 0.254: 17.6,22.9 17.6,22.4 15.35,20.15 15.35,16.65 | 17.6,22.9 v17.6,25.15 | 15.35,12.65 15.35,8.65 14.35,7.65 U$5.B+ | 15.35,12.65 15.35,16.65 | v11.85,21.15 11.85,22.15 12.6,22.9 17.6,22.9 | 15.35,16.65 v15.6,16.65 | 15.35,12.65 v10.35,12.65
N$5  (via drill 0.61)
  Top 0.254: v47.6,70.4 v41.35,70.4 | v75.35,70.4 76.6,71.65 OK3.3
  Bottom 0.254: v41.35,70.4 39.1,70.4 U$9.1 | v47.6,70.4 48.85,70.4 U$1.1 49.1,70.4 50.85,70.4 52.35,71.9 60.6,71.9 | v75.35,70.4 74.85,70.4 70.1,75.15 63.85,75.15 60.6,71.9 | 60.6,71.9 59.35,70.65 U$2.1
N$6  (via drill 0.61)
  Top 0.254: OK1.3 86.1,63.4 88.35,63.4 88.6,63.15 88.6,54.4 86.1,51.9 79.85,51.9 v79.35,52.4
  Bottom 0.254: v79.35,52.4 73.1,52.4 63.35,42.65 56.1,42.65 U$20.1
N$7
  Top 0.254: R10.1 76.35,74.4 77.6,73.15 77.85,73.15 78.1,72.9 78.1,66.15 74.35,62.4 OK3.1
N$8
  Top 0.254: R11.1 86.85,72.4 87.35,71.9 OK1.1
N$9  (via drill 0.61)
  Top 0.254: v88.35,12.15 88.6,12.4 88.6,13.4 SW2.COM2
  Bottom 0.254: v88.35,12.15 81.85,5.65 80.35,5.65 U$8.B+
N$10  (via drill 0.61)
  Top 0.254: v82.6,14.9 82.6,13.4 SW2.COM1
  Bottom 0.254: v82.6,14.9 82.6,44.9 93.1,55.4 93.1,77.15 80.35,89.9 U$8.B-
N$11
  Top 0.254: U$4.2 8.85,24.9 8.85,26.15 10.1,27.4 R7.1
N$13  (via drill 6.9 pad 9)
  other vias: 57.1,87.9
N$14  (via drill 6.9 pad 9)
  other vias: 37.4,88.3
N$17  (via drill 0.61)
  Top 0.254: v74.85,46.65 72.6,46.65 U$14.1 | v79.35,51.15 79.35,49.9 U4.3
  Top 0.406: U$13.P2 U4.3
  Bottom 0.254: v79.35,51.15 v74.85,46.65
N$19  (via drill 0.61)
  Top 0.254: v11.1,49.65 11.1,51.4 U$15.1 | v14.85,45.9 14.85,43.65 U2.3
  Top 0.406: U$16.P2 14.82,43.4 U2.3
  Bottom 0.254: v14.85,45.9 v11.1,49.65
N$20  (via drill 0.61)
  Top 0.254: v11.35,73.15 13.1,73.15 14.1,74.15 R12.1 | v11.35,62.15 11.35,61.4 12.1,60.65 OK2.1
  Bottom 0.254: v11.35,62.15 v11.35,73.15
N$22
  Top 0.254: OK2.3 14.85,70.4 23.6,70.4 25.85,72.65 29.85,72.65 31.35,71.15 32.1,71.15 JP8.2 32.1,70.9 34.35,68.65 35.6,68.65 JP7.1
N$58
  Top 0.254: U$6.2 12.35,29.65 11.35,29.65 7.1,33.9 R62.2
N$59
  Top 0.254: U$6.7 17.6,29.65 15.85,29.65 11.85,33.65 R63.1
N$60
  Top 0.254: U$6.6 17.6,28.15 16.35,28.15 11.6,32.9 11.1,32.9 10.85,33.15 10.85,35.4 11.6,36.15 R64.1
N$61
  Top 0.254: D6.C 15.85,33.65 13.85,33.65 R63.2
N$62
  Top 0.254: D5.C 15.6,36.4 13.6,36.4 R64.2
N$65  (via drill 0.61)
  Top 0.254: U$7.5 23.85,30.15 v23.85,31.15 23.85,32.9 C40.1 | v12.85,25.15 8.85,21.15 R65.1
  Bottom 0.254: v12.85,25.15 16.35,25.15 22.35,31.15 v23.85,31.15
N$66  (via drill 0.61)
  Top 0.254: T1.2 13.85,17.9 14.35,17.9 T1.3 14.6,18.15 14.6,19.4 17.85,22.65 39.1,22.65 41.6,25.15 41.6,27.4 40.85,28.15 | 40.85,28.15 40.6,28.4 25.6,28.4 24.6,29.4 23.1,29.4 22.6,29.9 U$7.6 22.6,30.15 22.6,32.65 22.35,32.9 C40.2 22.35,33.15 v22.35,34.4 | 40.85,28.15 65.35,28.15 77.35,16.15 82.35,16.15 SW2.CH1A
  Bottom 0.254: v22.35,34.4 22.35,39.65 14.35,47.65 14.35,91.65 U$5.B-
N$67  (via drill 0.61)
  Top 0.254: v22.6,26.15 22.6,27.65 U$7.1 | v16.35,19.9 16.35,19.4 15.1,18.15 T1.4
  Bottom 0.254: v16.35,19.9 v22.6,26.15
N$68
  Top 0.254: U$7.2 23.6,27.65 23.6,24.65 24.1,24.15 R66.2
N$69  (via drill 0.61)
  Top 0.254: v13.1,19.65 13.1,18.15 T1.1 | v12.85,21.9 12.85,23.4 13.1,23.65 T1.8
  Bottom 0.254: v13.1,19.65 13.1,21.65 v12.85,21.9
N$70
  Top 0.254: U$7.3 24.6,27.65 24.6,25.4 25.35,24.65 25.35,23.4 25.1,23.15 15.6,23.15 15.1,23.65 T1.5
R_3V3  (via drill 0.61)
  Top 0.254: v57.85,41.65 57.85,47.9 45.1,60.65 45.1,66.15 41.85,69.4 40.6,69.4 33.85,76.15 28.6,76.15 26.35,73.9 IC2.9
  Bottom 0.254: v57.85,41.65 57.85,26.4 SV3.8
R_INT  (via drill 0.61)
  Top 0.254: v23.35,36.9 21.35,34.9 21.35,30.15 22.6,28.9 24.35,28.9 26.85,26.4 40.1,26.4 SV3.1
  Bottom 0.254: v23.35,36.9 23.35,68.4 26.1,71.15 IC2.10
R_IO0
  Bottom 0.254: JP2.1 32.35,44.9 27.6,49.65 27.6,67.4 26.35,68.65 IC2.11
R_RX
  Top 0.254: IC2.14 26.35,60.9 34.1,53.15 34.1,51.4 SV2.2 34.35,51.15 34.35,47.9 34.6,47.65 34.6,38.15 30.6,34.15 JP5.2
  Bottom 0.254: X1.6 48.35,6.4 48.35,15.65 30.6,33.4 30.6,33.9 JP5.2
R_SCL  (via drill 0.61)
  Top 0.254: v30.35,38.65 28.85,38.65 28.6,38.4 16.1,38.4 v13.6,40.9
  Bottom 0.254: v30.35,38.65 35.35,33.65 45.6,33.65 52.85,26.4 SV3.6 | v13.6,40.9 13.6,45.15 4.85,53.9 4.85,61.4 3.85,62.4 2.85,62.4 2.1,63.15 2.1,64.9 3.35,66.15 IC2.5
R_SDA  (via drill 0.61)
  Top 0.254: v30.35,37.4 24.1,37.4 23.6,37.9 v14.6,37.9
  Bottom 0.254: v30.35,37.4 34.6,33.15 43.6,33.15 50.35,26.4 SV3.5 | v14.6,37.9 14.6,44.9 5.35,54.15 5.35,61.9 3.6,63.65 IC2.4
R_TX  (via drill 0.61)
  Top 0.254: IC2.15 26.1,58.65 25.1,59.65 25.1,61.65 25.85,62.4 26.85,62.4 36.6,52.65 36.6,51.4 SV2.3 36.6,51.15 36.6,33.65 v32.35,29.4
  Bottom 0.254: 30.6,27.65 28.1,30.15 JP6.1 | 30.6,27.65 47.35,10.9 47.35,6.4 X1.7 | 30.6,27.65 v32.35,29.4
RIGHT_CAM_5V  (via drill 0.61)
  Top 0.254: 20.1,59.15 25.85,64.9 26.85,64.9 39.1,52.65 39.1,51.4 SV2.4 | C10.+ 20.1,59.15 | 15.35,51.4 C1.1 12.1,54.65 1.6,54.65 | U2.2 U2.4 13.1,46.65 15.35,48.9 15.35,51.4 | 15.35,51.4 U$15.2 | 1.6,54.65 1.6,53.9 6.35,49.15 C12.+ | 1.6,54.65 1.6,71.9 3.35,73.65 IC2.8 | v6.35,72.9 20.1,59.15
  Bottom 0.254: v6.35,72.9 4.35,72.9 3.6,73.65 IC2.8
S
  Top 0.254: R12.2 12.35,74.15 6.1,74.15 4.6,72.65 3.1,72.65 2.1,71.65 2.1,62.4 3.35,61.15 IC2.3
SERVO_POWER
  Top 1.27: SW2.CH2B 88.78,5.18 85.6,2 30.3,2 26.4,5.9 JP3.2 JP4.2
SHUTTER_3V3  (via drill 0.61)
  Top 0.254: v36.1,77.15 19.6,77.15 12.85,70.4 12.35,70.4 OK2.4
  Bottom 0.254: 38.1,81.15 40.1,79.15 42.6,79.15 C3.1 | 38.1,75.15 v36.1,77.15 | 38.1,81.15 33.85,81.15 32.35,79.65 32.35,75.15 33.85,73.65 36.6,73.65 38.1,75.15 | 38.1,81.15 IC4.4 | 38.1,75.15 IC4.2
VBUS  (via drill 0.61)
  Top 0.254: D5.A 17.6,36.15 17.6,33.65 D6.A 17.85,33.4 17.85,30.9 U$6.8 17.6,30.65 v16.1,30.65 | U$6.4 12.6,26.9 10.6,24.9 U$4.1 10.35,24.65 9.85,24.65 v8.1,22.9 | v14.35,16.65 16.6,14.4 C38.A
  Bottom 0.254: v14.35,16.65 v8.1,22.9 8.35,22.9 v16.1,30.65
VCC  (via drill 0.61)
  Top 0.254: v21.1,21.65 21.1,19.15 SW1.CH1A | v31.1,72.65 v33.6,75.15 | v24.6,47.15 19.1,47.15 U$16.P1 | v83.35,59.9 83.35,53.65 U$13.P1
  Bottom 0.254: 34.6,76.4 35.6,75.4 IC4.3 | 34.6,76.4 33.6,77.4 C2.1 | 42.35,51.9 44.85,51.9 IC7.3 | 42.35,51.9 42.1,51.9 40.85,53.15 40.85,54.65 41.6,55.4 C5.1 41.6,55.65 30.1,67.15 30.1,71.65 v31.1,72.65 31.1,79.15 34.85,82.9 64.1,82.9 83.35,63.65 v83.35,59.9 | v21.1,21.65 21.1,23.4 26.1,28.4 26.1,35.65 31.1,40.65 | 42.35,51.9 31.1,40.65 | 34.6,76.4 33.6,75.4 v33.6,75.15 | 31.1,40.65 v24.6,47.15

### Text on the board
tPlace: Baseline | Right-CAM | Left-CAM | Structured Light | 5V | 5V | GND IO / IO GND | GND / R_RX / R_TX / 5V | GND / L_RX / L_TX / 5V | Srereo Camera v1.3 / 20200531 TonyGUO | L_IO0 / GND | R_IO0 / GND | L_TX < - > R_RX | R_TX < - > L_RX | L_SDA / L_SCL / GND / L_3V3 | Shutter | IMU | INT / / / / / / / / R_SDA / R_SCL / GND / R_3V3 | ToF | Signal / VCC / GND
bPlace: R_TX / R_RX / L_TX / LRX / / GND